# EAGLE design Protoshield V1.0 (EAGLE 9.6.2)
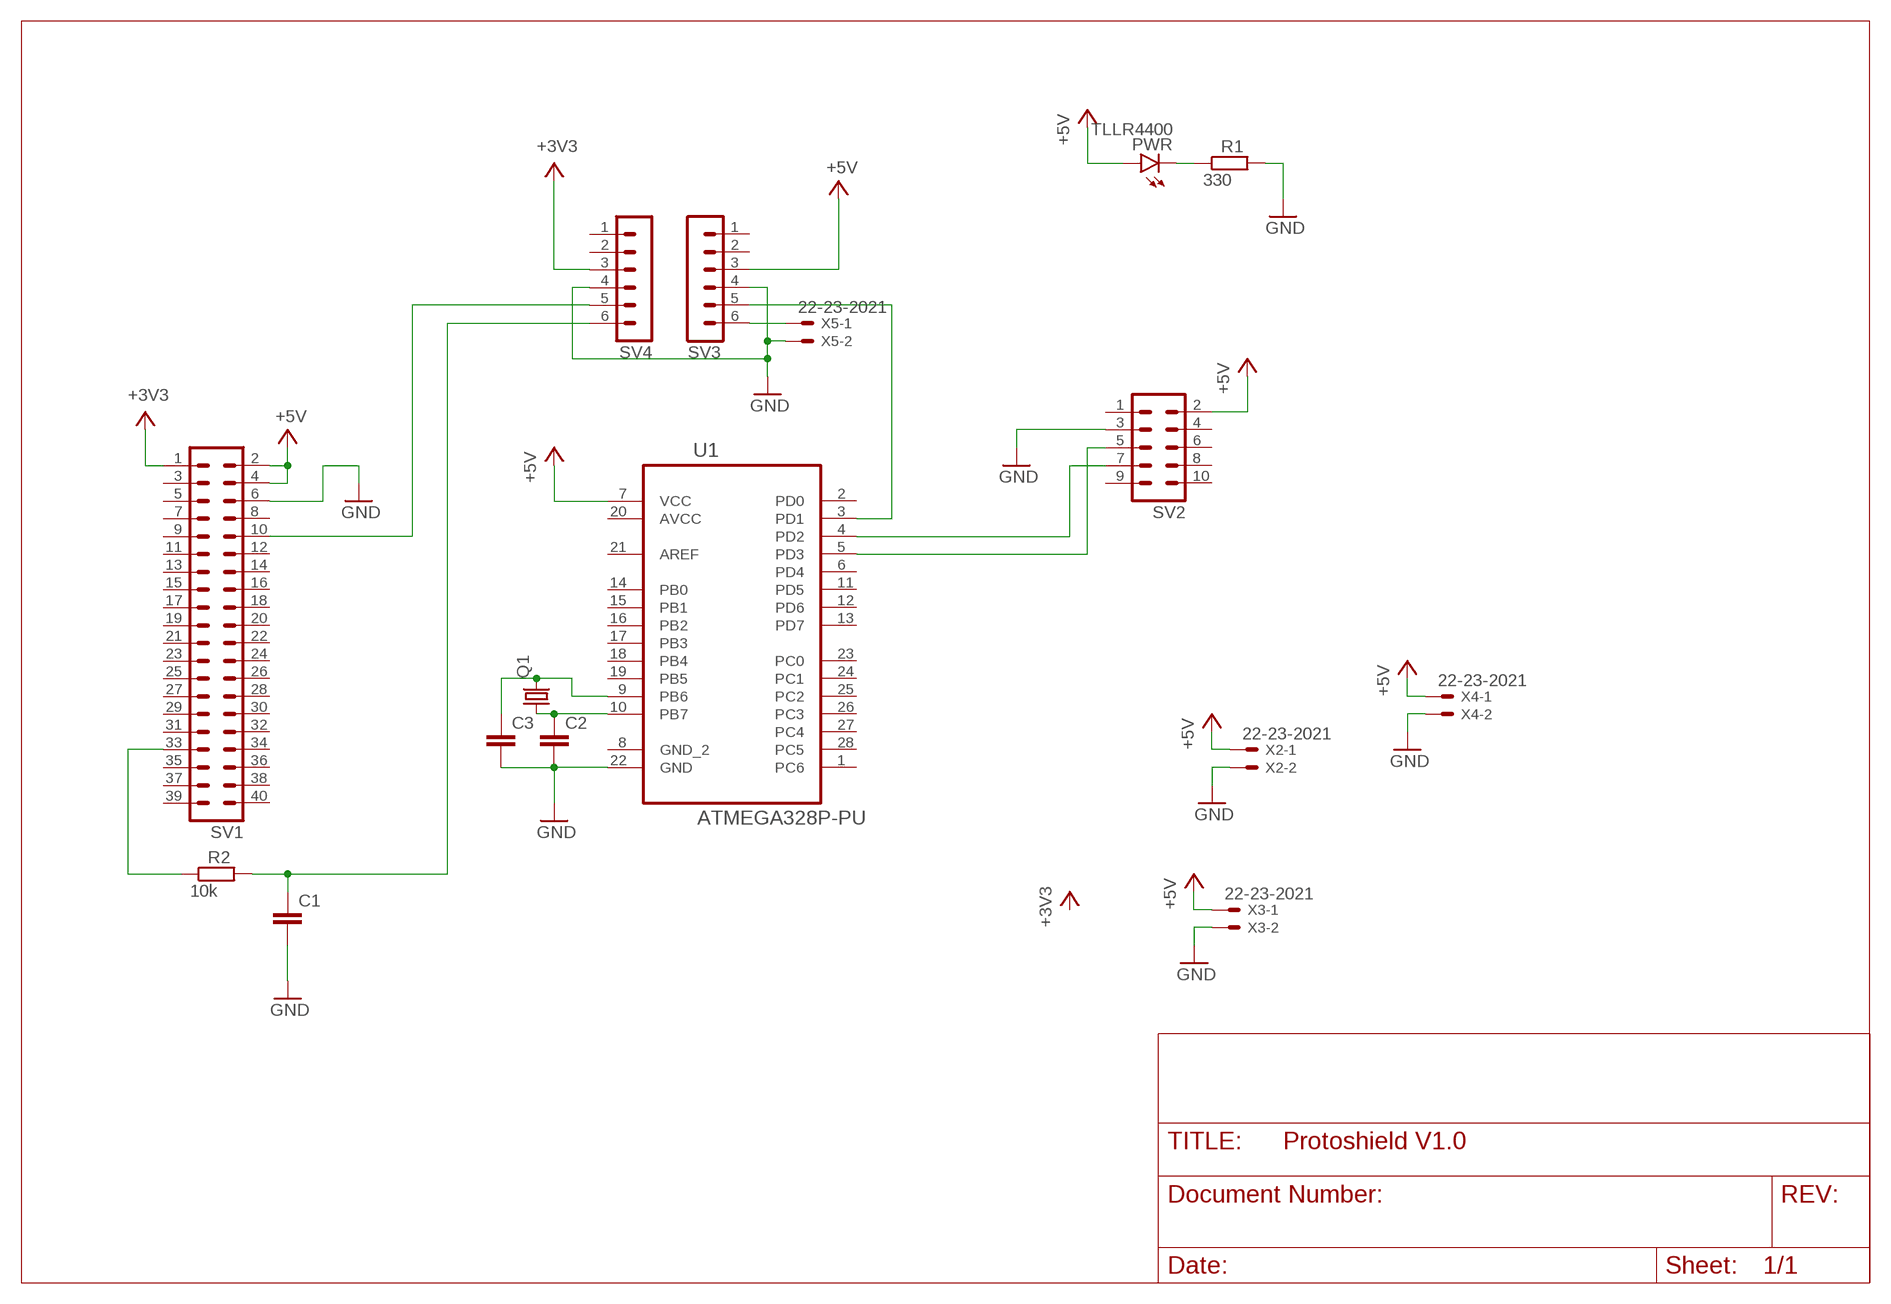
[diagram p0: schematic, sheet 1]

## Parts
C1  C-EU050-024X044  [C050-024X044]
C2  C-EU050-024X044  [C050-024X044]
C3  C-EU050-024X044  [C050-024X044]
PWR  TLLR4400  [LED3MM]
Q1  CRYSTALHC49S  [HC49/S]
R1  330  R-EU_0207/7  [0207/7]
R2  10k  R-EU_0207/7  [0207/7]
SV1  MA20-2  [MA20-2]
SV2  MA05-2  [MA05-2]
SV3  MA06-1  [MA06-1]
SV4  MA06-1  [MA06-1]
U1  ATMEGA328P-PU  [DIP254P762X457-28]
X2  22-23-2021  [22-23-2021]
X3  22-23-2021  [22-23-2021]
X4  22-23-2021  [22-23-2021]
X5  22-23-2021  [22-23-2021]

## Nets
+3V3: SV1.1 SV4.3
+5V: PWR.A SV1.2 SV1.4 SV2.2 SV3.3 U1.7(VCC) X2.1 X3.1 X4.1
GND: C1.2 C2.2 C3.2 R1.2 SV1.6 SV2.3 SV3.4 SV4.4 U1.22(GND) X2.2 X3.2 X4.2 X5.2
N$1: SV2.7 U1.4(PD2)
N$2: SV2.5 U1.5(PD3)
N$3: PWR.K(C) R1.1
N$38: SV3.6 X5.1
N$54: C3.1 Q1.2 U1.9(PB6)
N$151: C2.1 Q1.1 U1.10(PB7)
N$407: R2.1 SV1.33
N$436: SV3.5 U1.3(PD1)
N$437: SV1.10 SV4.5
N$438: C1.1 R2.2 SV4.6
Unconnected: SV1.3 SV1.5 SV1.7 SV1.8 SV1.9 SV1.11 SV1.12 SV1.13 SV1.14 SV1.15 SV1.16 SV1.17 SV1.18 SV1.19 SV1.20 SV1.21 SV1.22 SV1.23 SV1.24 SV1.25 SV1.26 SV1.27 SV1.28 SV1.29 SV1.30 SV1.31 SV1.32 SV1.34 SV1.35 SV1.36 SV1.37 SV1.38 SV1.39 SV1.40 SV2.1 SV2.4 SV2.6 SV2.8 SV2.9 SV2.10 SV3.1 SV3.2 SV4.1 SV4.2 U1.1(PC6) U1.2(PD0) U1.6(PD4) U1.8(GND_2) U1.11(PD5) U1.12(PD6) U1.13(PD7) U1.14(PB0) U1.15(PB1) U1.16(PB2) U1.17(PB3) U1.18(PB4) U1.19(PB5) U1.21(AREF) U1.23(PC0) U1.24(PC1) U1.25(PC2) U1.26(PC3) U1.27(PC4) U1.28(PC5)

## Power pins joined to a net without a drawn wire
AVCC: U1.20(AVCC)

## Library data of the parts
C1-C3 = rcl:C-EU: CAPACITOR, European symbol; SPICEPREFIX: C
PWR = led:TLLR4400: Low Current (2mA) LED 3 mm Tinted Diffused Package color RED Source: Data sheet <http://www.farnell.com/datasheets/391100.pdf>; MF: VISHAY SEMICONDUCTOR; OC_FARNELL: 1612437
Q1 = crystal:CRYSTAL: CRYSTAL; OC_FARNELL: 1667008; OC_NEWARK: unknown
R1 R2 = rcl:R-EU_: RESISTOR, European symbol; SPICEPREFIX: R
SV1 = con-lstb:MA20-2: PIN HEADER; OC_FARNELL: unknown; OC_NEWARK: unknown
SV2 = con-lstb:MA05-2: PIN HEADER; OC_FARNELL: unknown; OC_NEWARK: unknown
SV3 SV4 = con-lstb:MA06-1: PIN HEADER; OC_FARNELL: unknown; OC_NEWARK: unknown
U1 = Atmel_By_element14_Batch_1-00:ATMEGA328P-PU: 8-bit Microcontroller with In-System Programmable Flash; MPN: ATMEGA328P-PU; OC_FARNELL: 1715487; OC_NEWARK: 15R0268; PACKAGE: PDIP-28; SUPPLIER: Atmel
X2-X5 = con-molex:22-23-2021: .100" (2.54mm) Center Header - 2 Pin; MF: MOLEX; MPN: 22-23-2021; OC_FARNELL: 1462926; OC_NEWARK: 25C3832

## Board
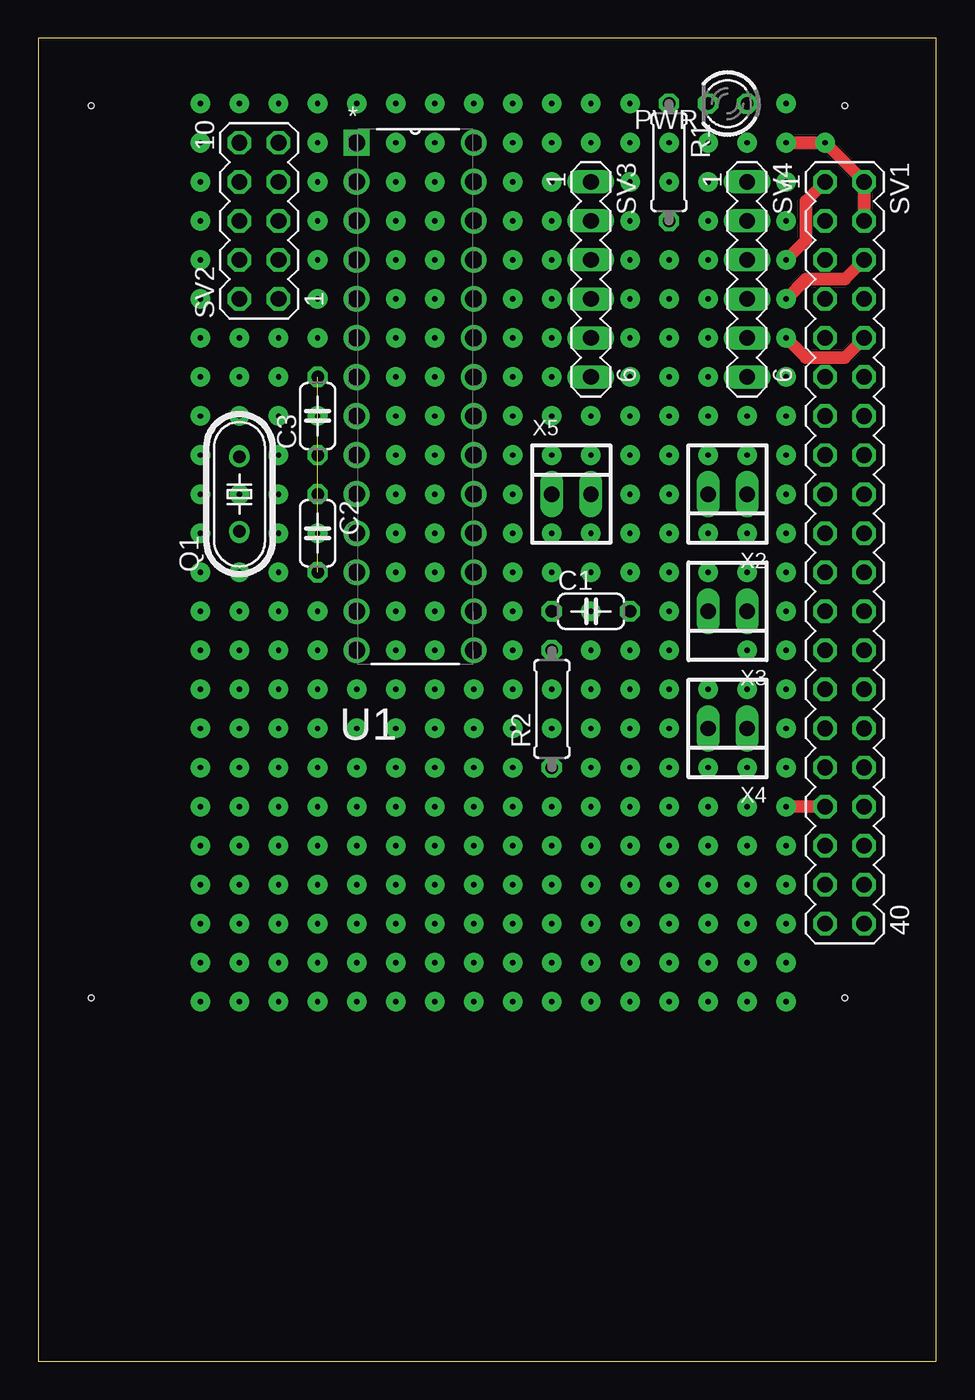
[diagram p1: board, top side]
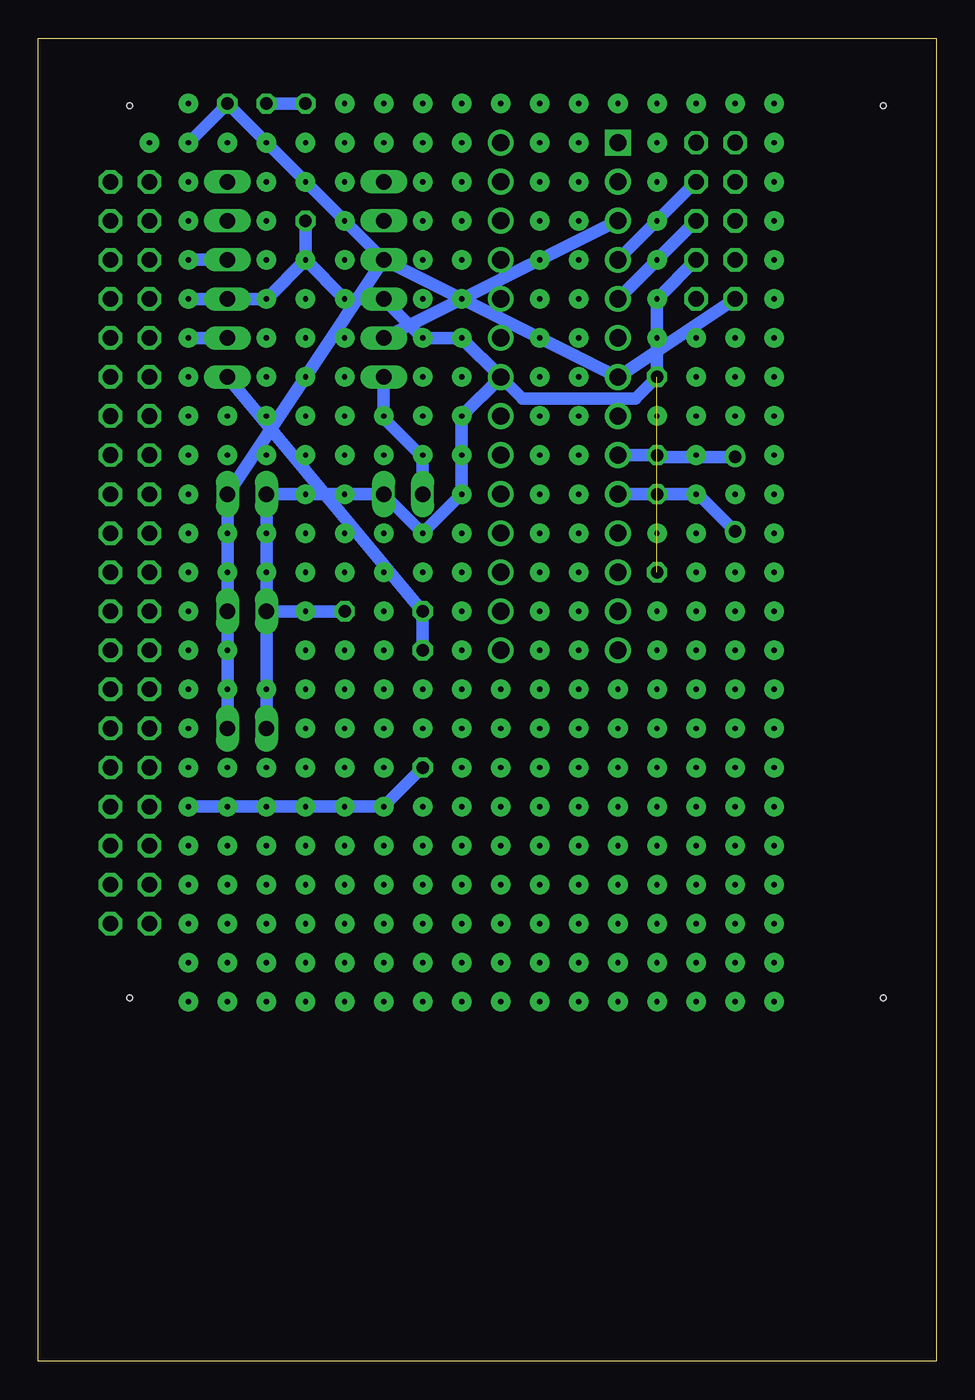
[diagram p2: board, bottom side, seen from below]

Size 58.4 x 86.03 mm. Coordinates in mm from the lower left corner, seen from the top.
Outline: 0,0 58.4,0 58.4,86.03 0,86.03 0,0
Copper layers (1*16): Top 0.035mm / dielectric 1.5mm / Bottom 0.035mm
Design rules "default": minimum track width 6mil, minimum drill 0.35mm, track to track 6mil, track to pad 6mil, pad to pad 6mil, via to via 6mil, smd to smd 6mil, copper to edge 40mil, drill to drill 6mil, minimum pad ring 10mil, minimum via ring 8mil, stop-mask expansion 4mil, vias tented up to drill 0mil, thermal gap 10mil
Holes 0.35 mm at 52.45,23.62 3.43,23.62 3.43,81.66 52.45,81.66

### Footprints (pad centres in the part's own frame; a part is rotated, then mirrored left to right if it is on the bottom)
C050-024X044 = drill 0.813 octagon: 1 -2.54,0; 2 2.54,0
LED3MM = drill 0.813 octagon: A -1.27,0; K 1.27,0
HC49/S = drill 0.813: 1 -2.413,0; 2 2.413,0
0207/7 = drill 0.813 octagon: 1 -3.81,0; 2 3.81,0
MA20-2 = drill 1.016 octagon: 1 -24.13,-1.27; 2 -24.13,1.27; 3 -21.59,-1.27; 4 -21.59,1.27; 5 -19.05,-1.27; 6 -19.05,1.27; 7 -16.51,-1.27; 8 -16.51,1.27; 9 -13.97,-1.27; 10 -13.97,1.27; 11 -11.43,-1.27; 12 -11.43,1.27; 13 -8.89,-1.27; 14 -8.89,1.27; 15 -6.35,-1.27; 16 -6.35,1.27; 17 -3.81,-1.27; 18 -3.81,1.27; 19 -1.27,-1.27; 20 -1.27,1.27; 21 1.27,-1.27; 22 1.27,1.27; 23 3.81,-1.27; 24 3.81,1.27; 25 6.35,-1.27; 26 6.35,1.27; 27 8.89,-1.27; 28 8.89,1.27; 29 11.43,-1.27; 30 11.43,1.27; 31 13.97,-1.27; 32 13.97,1.27; 33 16.51,-1.27; 34 16.51,1.27; 35 19.05,-1.27; 36 19.05,1.27; 37 21.59,-1.27; 38 21.59,1.27; 39 24.13,-1.27; 40 24.13,1.27
MA05-2 = drill 1.016 octagon: 1 -5.08,-1.27; 2 -5.08,1.27; 3 -2.54,-1.27; 4 -2.54,1.27; 5 0,-1.27; 6 0,1.27; 7 2.54,-1.27; 8 2.54,1.27; 9 5.08,-1.27; 10 5.08,1.27
MA06-1 = drill 1.016 long: 1 -6.35,0; 2 -3.81,0; 3 -1.27,0; 4 1.27,0; 5 3.81,0; 6 6.35,0
DIP254P762X457-28 = drill 1.118 square: 1 -7.62,33.02 | drill 1.118: 2 -7.62,30.48; 3 -7.62,27.94; 4 -7.62,25.4; 5 -7.62,22.86; 6 -7.62,20.32; 7 -7.62,17.78; 8 -7.62,15.24; 9 -7.62,12.7; 10 -7.62,10.16; 11 -7.62,7.62; 12 -7.62,5.08; 13 -7.62,2.54; 14 -7.62,0; 15 0,0; 16 0,2.54; 17 0,5.08; 18 0,7.62; 19 0,10.16; 20 0,12.7; 21 0,15.24; 22 0,17.78; 23 0,20.32; 24 0,22.86; 25 0,25.4; 26 0,27.94; 27 0,30.48; 28 0,33.02
22-23-2021 = drill 1 long: 1 -1.27,0; 2 1.27,0

### Placement (x,y rotation side)
C1  35.94,48.77 0 top
C2  18.16,53.85 270 top
C3  18.16,61.47 90 top
PWR  44.83,81.79 180 top
Q1  13.08,56.39 90 top
R1  41.02,77.98 270 top
R2  33.4,42.42 90 top
SV1  52.45,52.58 270 top
SV2  14.35,74.17 90 top
SV3  35.94,70.36 270 top
SV4  46.1,70.36 270 top
U1  28.32,46.23 0 top
X2  44.83,56.39 180 top
X3  44.83,48.77 180 top
X4  44.83,41.15 180 top
X5  34.67,56.39 0 top

### Tracks (layer width: path | path; a pad name or v marks a point on that pad's centre or on a via)
+3V3  (via drill 0.35 pad 1.27)
  Top 0.813: SV1.1 49.91,75.44 49.91,72.9 v48.64,71.63
  Bottom 0.813: v48.64,71.63 SV4.3
+5V  (via drill 0.35 pad 1.27)
  Top 0.813: v48.64,79.25 51.18,79.25 SV1.2 SV1.4
  Bottom 0.813: X4.1 X3.1 X2.1 SV3.3 | v48.64,79.25 PWR.A SV3.3 | SV2.2 U1.7 SV3.3
GND  (via drill 0.35 pad 1.27)  (1 unrouted)
  Top 0.813: SV1.6 52.45,70.36 49.91,70.36 v48.64,69.09
  Bottom 0.813: X4.2 X3.2 | X3.2 X2.2 X5.2 33.4,53.85 30.86,56.39 30.86,61.47 U1.22 | C1.2 X3.2 | v41.02,71.63 43.56,69.09 SV4.4 v48.64,69.09 | v41.02,71.63 38.48,69.09 SV3.4 33.4,66.55 30.86,66.55 U1.22 | v41.02,71.63 R1.2 | U1.22 26.92,62.61 19.56,62.61 C3.2 18.16,69.09 SV2.3
N$1
  Bottom 0.813: U1.4 SV2.7
N$2
  Bottom 0.813: U1.5 SV2.5
N$3
  Bottom 0.813: R1.1 PWR.K
N$4  (via drill 0.35 pad 1.27)
  other vias: 51.18,79.25
N$5  (via drill 0.35 pad 1.27)
  other vias: 48.64,74.17
N$6  (via drill 0.35 pad 1.27)
  other vias: 46.1,76.71
N$7  (via drill 0.35 pad 1.27)
  other vias: 38.48,76.71
N$8  (via drill 0.35 pad 1.27)
  other vias: 43.56,76.71
N$9  (via drill 0.35 pad 1.27)
  other vias: 41.02,76.71
N$10  (via drill 0.35 pad 1.27)
  other vias: 35.94,76.71
N$11  (via drill 0.35 pad 1.27)
  other vias: 33.4,76.71
N$12  (via drill 0.35 pad 1.27)
  other vias: 46.1,74.17
N$13  (via drill 0.35 pad 1.27)
  other vias: 43.56,74.17
N$14  (via drill 0.35 pad 1.27)
  other vias: 38.48,74.17
N$15  (via drill 0.35 pad 1.27)
  other vias: 41.02,74.17
N$16  (via drill 0.35 pad 1.27)
  other vias: 35.94,74.17
N$17  (via drill 0.35 pad 1.27)
  other vias: 33.4,74.17
N$18  (via drill 0.35 pad 1.27)
  other vias: 30.86,76.71
N$19  (via drill 0.35 pad 1.27)
  other vias: 28.32,76.71
N$20  (via drill 0.35 pad 1.27)
  other vias: 25.78,76.71
N$21  (via drill 0.35 pad 1.27)
  other vias: 20.7,76.71
N$22  (via drill 0.35 pad 1.27)
  other vias: 23.24,76.71
N$23  (via drill 0.35 pad 1.27)
  other vias: 18.16,76.71
N$24  (via drill 0.35 pad 1.27)
  other vias: 15.62,76.71
N$25  (via drill 0.35 pad 1.27)
  other vias: 30.86,74.17
N$26  (via drill 0.35 pad 1.27)
  other vias: 28.32,74.17
N$27  (via drill 0.35 pad 1.27)
  other vias: 25.78,74.17
N$28  (via drill 0.35 pad 1.27)
  other vias: 20.7,74.17
N$29  (via drill 0.35 pad 1.27)
  other vias: 23.24,74.17
N$30  (via drill 0.35 pad 1.27)
  other vias: 18.16,74.17
N$31  (via drill 0.35 pad 1.27)
  other vias: 15.62,74.17
N$32  (via drill 0.35 pad 1.27)
  other vias: 10.54,76.71
N$33  (via drill 0.35 pad 1.27)
  other vias: 13.08,76.71
N$34  (via drill 0.35 pad 1.27)
  other vias: 48.64,76.71
N$35  (via drill 0.35 pad 1.27)
  other vias: 41.02,38.61
N$36  (via drill 0.35 pad 1.27)
  other vias: 10.54,74.17
N$37  (via drill 0.35 pad 1.27)
  other vias: 13.08,74.17
N$38
  Bottom 0.813: X5.1 33.4,58.8 35.94,61.34 SV3.6
N$39  (via drill 0.35 pad 1.27)
  other vias: 48.64,79.25
N$41  (via drill 0.35 pad 1.27)
  other vias: 46.1,71.63
N$42  (via drill 0.35 pad 1.27)
  other vias: 43.56,71.63
N$43  (via drill 0.35 pad 1.27)
  other vias: 38.48,71.63
N$45  (via drill 0.35 pad 1.27)
  other vias: 35.94,71.63
N$46  (via drill 0.35 pad 1.27)
  other vias: 33.4,71.63
N$47  (via drill 0.35 pad 1.27)
  other vias: 41.02,64.01
N$48  (via drill 0.35 pad 1.27)
  other vias: 46.1,69.09
N$49  (via drill 0.35 pad 1.27)
  other vias: 43.56,69.09
N$50  (via drill 0.35 pad 1.27)
  other vias: 38.48,69.09
N$51  (via drill 0.35 pad 1.27)
  other vias: 41.02,69.09
N$52  (via drill 0.35 pad 1.27)
  other vias: 35.94,69.09
N$53  (via drill 0.35 pad 1.27)
  other vias: 33.4,69.09
N$54
  Bottom 0.813: U1.9 C3.1 18.03,58.8 Q1.2
N$55  (via drill 0.35 pad 1.27)
  other vias: 28.32,71.63
N$56  (via drill 0.35 pad 1.27)
  other vias: 25.78,71.63
N$57  (via drill 0.35 pad 1.27)
  other vias: 20.7,71.63
N$58  (via drill 0.35 pad 1.27)
  other vias: 23.24,71.63
N$59  (via drill 0.35 pad 1.27)
  other vias: 18.16,71.63
N$60  (via drill 0.35 pad 1.27)
  other vias: 15.62,71.63
N$61  (via drill 0.35 pad 1.27)
  other vias: 30.86,69.09
N$62  (via drill 0.35 pad 1.27)
  other vias: 28.32,69.09
N$63  (via drill 0.35 pad 1.27)
  other vias: 25.78,69.09
N$64  (via drill 0.35 pad 1.27)
  other vias: 20.7,69.09
N$65  (via drill 0.35 pad 1.27)
  other vias: 23.24,69.09
N$66  (via drill 0.35 pad 1.27)
  other vias: 18.16,69.09
N$67  (via drill 0.35 pad 1.27)
  other vias: 15.62,69.09
N$68  (via drill 0.35 pad 1.27)
  other vias: 10.54,71.63
N$69  (via drill 0.35 pad 1.27)
  other vias: 13.08,71.63
N$72  (via drill 0.35 pad 1.27)
  other vias: 10.54,69.09
N$73  (via drill 0.35 pad 1.27)
  other vias: 13.08,69.09
N$76  (via drill 0.35 pad 1.27)
  other vias: 48.64,66.55
N$77  (via drill 0.35 pad 1.27)
  other vias: 46.1,66.55
N$78  (via drill 0.35 pad 1.27)
  other vias: 43.56,66.55
N$79  (via drill 0.35 pad 1.27)
  other vias: 38.48,66.55
N$80  (via drill 0.35 pad 1.27)
  other vias: 41.02,66.55
N$81  (via drill 0.35 pad 1.27)
  other vias: 35.94,66.55
N$82  (via drill 0.35 pad 1.27)
  other vias: 33.4,66.55
N$83  (via drill 0.35 pad 1.27)
  other vias: 48.64,64.01
N$84  (via drill 0.35 pad 1.27)
  other vias: 46.1,64.01
N$85  (via drill 0.35 pad 1.27)
  other vias: 43.56,64.01
N$86  (via drill 0.35 pad 1.27)
  other vias: 38.48,64.01
N$87  (via drill 0.35 pad 1.27)
  other vias: 48.64,71.63
N$88  (via drill 0.35 pad 1.27)
  other vias: 35.94,64.01
N$89  (via drill 0.35 pad 1.27)
  other vias: 33.4,64.01
N$90  (via drill 0.35 pad 1.27)
  other vias: 30.86,66.55
N$91  (via drill 0.35 pad 1.27)
  other vias: 28.32,66.55
N$92  (via drill 0.35 pad 1.27)
  other vias: 25.78,66.55
N$93  (via drill 0.35 pad 1.27)
  other vias: 20.7,66.55
N$94  (via drill 0.35 pad 1.27)
  other vias: 23.24,66.55
N$95  (via drill 0.35 pad 1.27)
  other vias: 18.16,66.55
N$96  (via drill 0.35 pad 1.27)
  other vias: 15.62,66.55
N$97  (via drill 0.35 pad 1.27)
  other vias: 30.86,64.01
N$98  (via drill 0.35 pad 1.27)
  other vias: 28.32,64.01
N$99  (via drill 0.35 pad 1.27)
  other vias: 25.78,64.01
N$100  (via drill 0.35 pad 1.27)
  other vias: 20.7,64.01
N$101  (via drill 0.35 pad 1.27)
  other vias: 23.24,64.01
N$102  (via drill 0.35 pad 1.27)
  other vias: 18.16,64.01
N$103  (via drill 0.35 pad 1.27)
  other vias: 15.62,64.01
N$104  (via drill 0.35 pad 1.27)
  other vias: 10.54,66.55
N$105  (via drill 0.35 pad 1.27)
  other vias: 13.08,66.55
N$108  (via drill 0.35 pad 1.27)
  other vias: 10.54,64.01
N$109  (via drill 0.35 pad 1.27)
  other vias: 13.08,64.01
N$112  (via drill 0.35 pad 1.27)
  other vias: 48.64,61.47
N$113  (via drill 0.35 pad 1.27)
  other vias: 46.1,61.47
N$114  (via drill 0.35 pad 1.27)
  other vias: 43.56,61.47
N$115  (via drill 0.35 pad 1.27)
  other vias: 38.48,61.47
N$116  (via drill 0.35 pad 1.27)
  other vias: 41.02,61.47
N$117  (via drill 0.35 pad 1.27)
  other vias: 35.94,61.47
N$118  (via drill 0.35 pad 1.27)
  other vias: 33.4,61.47
N$119  (via drill 0.35 pad 1.27)
  other vias: 48.64,58.93
N$120  (via drill 0.35 pad 1.27)
  other vias: 46.1,58.93
N$122  (via drill 0.35 pad 1.27)
  other vias: 38.48,58.93
N$123  (via drill 0.35 pad 1.27)
  other vias: 41.02,58.93
N$124  (via drill 0.35 pad 1.27)
  other vias: 35.94,58.93
N$125  (via drill 0.35 pad 1.27)
  other vias: 33.4,58.93
N$126  (via drill 0.35 pad 1.27)
  other vias: 30.86,61.47
N$127  (via drill 0.35 pad 1.27)
  other vias: 28.32,61.47
N$128  (via drill 0.35 pad 1.27)
  other vias: 25.78,61.47
N$129  (via drill 0.35 pad 1.27)
  other vias: 20.7,61.47
N$130  (via drill 0.35 pad 1.27)
  other vias: 23.24,61.47
N$131  (via drill 0.35 pad 1.27)
  other vias: 18.16,61.47
N$132  (via drill 0.35 pad 1.27)
  other vias: 15.62,61.47
N$133  (via drill 0.35 pad 1.27)
  other vias: 30.86,58.93
N$134  (via drill 0.35 pad 1.27)
  other vias: 28.32,58.93
N$135  (via drill 0.35 pad 1.27)
  other vias: 25.78,58.93
N$136  (via drill 0.35 pad 1.27)
  other vias: 20.7,58.93
N$137  (via drill 0.35 pad 1.27)
  other vias: 23.24,58.93
N$138  (via drill 0.35 pad 1.27)
  other vias: 18.16,58.93
N$139  (via drill 0.35 pad 1.27)
  other vias: 15.62,58.93
N$140  (via drill 0.35 pad 1.27)
  other vias: 10.54,61.47
N$141  (via drill 0.35 pad 1.27)
  other vias: 13.08,61.47
N$144  (via drill 0.35 pad 1.27)
  other vias: 10.54,58.93
N$145  (via drill 0.35 pad 1.27)
  other vias: 13.08,58.93
N$148  (via drill 0.35 pad 1.27)
  other vias: 48.64,56.39
N$149  (via drill 0.35 pad 1.27)
  other vias: 46.1,56.39
N$150  (via drill 0.35 pad 1.27)
  other vias: 43.56,56.39
N$151
  Bottom 0.813: U1.10 C2.1 15.49,56.39 Q1.1
N$152  (via drill 0.35 pad 1.27)
  other vias: 41.02,56.39
N$153  (via drill 0.35 pad 1.27)
  other vias: 35.94,56.39
N$154  (via drill 0.35 pad 1.27)
  other vias: 33.4,56.39
N$155  (via drill 0.35 pad 1.27)
  other vias: 48.64,53.85
N$156  (via drill 0.35 pad 1.27)
  other vias: 46.1,53.85
N$157  (via drill 0.35 pad 1.27)
  other vias: 43.56,53.85
N$158  (via drill 0.35 pad 1.27)
  other vias: 38.48,53.85
N$159  (via drill 0.35 pad 1.27)
  other vias: 41.02,53.85
N$160  (via drill 0.35 pad 1.27)
  other vias: 35.94,53.85
N$161  (via drill 0.35 pad 1.27)
  other vias: 33.4,53.85
N$162  (via drill 0.35 pad 1.27)
  other vias: 30.86,56.39
N$163  (via drill 0.35 pad 1.27)
  other vias: 28.32,56.39
N$164  (via drill 0.35 pad 1.27)
  other vias: 25.78,56.39
N$165  (via drill 0.35 pad 1.27)
  other vias: 20.7,56.39
N$166  (via drill 0.35 pad 1.27)
  other vias: 23.24,56.39
N$167  (via drill 0.35 pad 1.27)
  other vias: 18.16,56.39
N$168  (via drill 0.35 pad 1.27)
  other vias: 15.62,56.39
N$169  (via drill 0.35 pad 1.27)
  other vias: 30.86,53.85
N$170  (via drill 0.35 pad 1.27)
  other vias: 28.32,53.85
N$171  (via drill 0.35 pad 1.27)
  other vias: 25.78,53.85
N$172  (via drill 0.35 pad 1.27)
  other vias: 20.7,53.85
N$173  (via drill 0.35 pad 1.27)
  other vias: 23.24,53.85
N$174  (via drill 0.35 pad 1.27)
  other vias: 18.16,53.85
N$175  (via drill 0.35 pad 1.27)
  other vias: 15.62,53.85
N$176  (via drill 0.35 pad 1.27)
  other vias: 10.54,56.39
N$177  (via drill 0.35 pad 1.27)
  other vias: 13.08,56.39
N$180  (via drill 0.35 pad 1.27)
  other vias: 10.54,53.85
N$181  (via drill 0.35 pad 1.27)
  other vias: 13.08,53.85
N$184  (via drill 0.35 pad 1.27)
  other vias: 48.64,51.31
N$185  (via drill 0.35 pad 1.27)
  other vias: 46.1,51.31
N$186  (via drill 0.35 pad 1.27)
  other vias: 43.56,51.31
N$187  (via drill 0.35 pad 1.27)
  other vias: 38.48,51.31
N$188  (via drill 0.35 pad 1.27)
  other vias: 41.02,51.31
N$189  (via drill 0.35 pad 1.27)
  other vias: 35.94,51.31
N$190  (via drill 0.35 pad 1.27)
  other vias: 33.4,51.31
N$191  (via drill 0.35 pad 1.27)
  other vias: 48.64,48.77
N$192  (via drill 0.35 pad 1.27)
  other vias: 46.1,48.77
N$193  (via drill 0.35 pad 1.27)
  other vias: 43.56,48.77
N$194  (via drill 0.35 pad 1.27)
  other vias: 38.48,48.77
N$195  (via drill 0.35 pad 1.27)
  other vias: 41.02,48.77
N$196  (via drill 0.35 pad 1.27)
  other vias: 35.94,48.77
N$197  (via drill 0.35 pad 1.27)
  other vias: 33.4,48.77
N$198  (via drill 0.35 pad 1.27)
  other vias: 30.86,51.31
N$199  (via drill 0.35 pad 1.27)
  other vias: 28.32,51.31
N$200  (via drill 0.35 pad 1.27)
  other vias: 25.78,51.31
N$201  (via drill 0.35 pad 1.27)
  other vias: 20.7,51.31
N$202  (via drill 0.35 pad 1.27)
  other vias: 23.24,51.31
N$203  (via drill 0.35 pad 1.27)
  other vias: 18.16,51.31
N$204  (via drill 0.35 pad 1.27)
  other vias: 15.62,51.31
N$205  (via drill 0.35 pad 1.27)
  other vias: 30.86,48.77
N$206  (via drill 0.35 pad 1.27)
  other vias: 28.32,48.77
N$207  (via drill 0.35 pad 1.27)
  other vias: 25.78,48.77
N$208  (via drill 0.35 pad 1.27)
  other vias: 20.7,48.77
N$209  (via drill 0.35 pad 1.27)
  other vias: 23.24,48.77
N$210  (via drill 0.35 pad 1.27)
  other vias: 18.16,48.77
N$211  (via drill 0.35 pad 1.27)
  other vias: 15.62,48.77
N$212  (via drill 0.35 pad 1.27)
  other vias: 10.54,51.31
N$213  (via drill 0.35 pad 1.27)
  other vias: 13.08,51.31
N$216  (via drill 0.35 pad 1.27)
  other vias: 10.54,48.77
N$217  (via drill 0.35 pad 1.27)
  other vias: 13.08,48.77
N$220  (via drill 0.35 pad 1.27)
  other vias: 48.64,46.23
N$221  (via drill 0.35 pad 1.27)
  other vias: 46.1,46.23
N$222  (via drill 0.35 pad 1.27)
  other vias: 43.56,58.93
N$223  (via drill 0.35 pad 1.27)
  other vias: 38.48,46.23
N$224  (via drill 0.35 pad 1.27)
  other vias: 41.02,46.23
N$225  (via drill 0.35 pad 1.27)
  other vias: 35.94,46.23
N$226  (via drill 0.35 pad 1.27)
  other vias: 33.4,46.23
N$227  (via drill 0.35 pad 1.27)
  other vias: 48.64,43.69
N$228  (via drill 0.35 pad 1.27)
  other vias: 46.1,43.69
N$229  (via drill 0.35 pad 1.27)
  other vias: 43.56,43.69
N$230  (via drill 0.35 pad 1.27)
  other vias: 38.48,43.69
N$231  (via drill 0.35 pad 1.27)
  other vias: 41.02,43.69
N$232  (via drill 0.35 pad 1.27)
  other vias: 35.94,43.69
N$233  (via drill 0.35 pad 1.27)
  other vias: 33.4,43.69
N$234  (via drill 0.35 pad 1.27)
  other vias: 30.86,46.23
N$235  (via drill 0.35 pad 1.27)
  other vias: 28.32,46.23
N$236  (via drill 0.35 pad 1.27)
  other vias: 25.78,46.23
N$237  (via drill 0.35 pad 1.27)
  other vias: 20.7,46.23
N$238  (via drill 0.35 pad 1.27)
  other vias: 23.24,46.23
N$239  (via drill 0.35 pad 1.27)
  other vias: 18.16,46.23
N$240  (via drill 0.35 pad 1.27)
  other vias: 15.62,46.23
N$241  (via drill 0.35 pad 1.27)
  other vias: 30.86,43.69
N$242  (via drill 0.35 pad 1.27)
  other vias: 28.32,43.69
N$243  (via drill 0.35 pad 1.27)
  other vias: 25.78,43.69
N$244  (via drill 0.35 pad 1.27)
  other vias: 20.7,43.69
N$245  (via drill 0.35 pad 1.27)
  other vias: 23.24,43.69
N$246  (via drill 0.35 pad 1.27)
  other vias: 18.16,43.69
N$247  (via drill 0.35 pad 1.27)
  other vias: 15.62,43.69
N$248  (via drill 0.35 pad 1.27)
  other vias: 10.54,46.23
N$249  (via drill 0.35 pad 1.27)
  other vias: 13.08,46.23
N$252  (via drill 0.35 pad 1.27)
  other vias: 10.54,43.69
N$253  (via drill 0.35 pad 1.27)
  other vias: 13.08,43.69
N$256  (via drill 0.35 pad 1.27)
  other vias: 48.64,41.15
N$257  (via drill 0.35 pad 1.27)
  other vias: 46.1,41.15
N$258  (via drill 0.35 pad 1.27)
  other vias: 43.56,41.15
N$259  (via drill 0.35 pad 1.27)
  other vias: 38.48,41.15
N$260  (via drill 0.35 pad 1.27)
  other vias: 41.02,41.15
N$261  (via drill 0.35 pad 1.27)
  other vias: 35.94,41.15
N$262  (via drill 0.35 pad 1.27)
  other vias: 33.4,41.15
N$263  (via drill 0.35 pad 1.27)
  other vias: 48.64,38.61
N$264  (via drill 0.35 pad 1.27)
  other vias: 46.1,38.61
N$265  (via drill 0.35 pad 1.27)
  other vias: 43.56,38.61
N$266  (via drill 0.35 pad 1.27)
  other vias: 38.48,38.61
N$268  (via drill 0.35 pad 1.27)
  other vias: 35.94,38.61
N$269  (via drill 0.35 pad 1.27)
  other vias: 33.4,38.61
N$270  (via drill 0.35 pad 1.27)
  other vias: 30.86,41.15
N$271  (via drill 0.35 pad 1.27)
  other vias: 28.32,41.15
N$272  (via drill 0.35 pad 1.27)
  other vias: 25.78,41.15
N$273  (via drill 0.35 pad 1.27)
  other vias: 20.7,41.15
N$274  (via drill 0.35 pad 1.27)
  other vias: 23.24,41.15
N$275  (via drill 0.35 pad 1.27)
  other vias: 18.16,41.15
N$276  (via drill 0.35 pad 1.27)
  other vias: 15.62,41.15
N$277  (via drill 0.35 pad 1.27)
  other vias: 30.86,38.61
N$278  (via drill 0.35 pad 1.27)
  other vias: 28.32,38.61
N$279  (via drill 0.35 pad 1.27)
  other vias: 25.78,38.61
N$280  (via drill 0.35 pad 1.27)
  other vias: 20.7,38.61
N$281  (via drill 0.35 pad 1.27)
  other vias: 23.24,38.61
N$282  (via drill 0.35 pad 1.27)
  other vias: 18.16,38.61
N$283  (via drill 0.35 pad 1.27)
  other vias: 15.62,38.61
N$284  (via drill 0.35 pad 1.27)
  other vias: 10.54,41.15
N$285  (via drill 0.35 pad 1.27)
  other vias: 13.08,41.15
N$288  (via drill 0.35 pad 1.27)
  other vias: 10.54,38.61
N$289  (via drill 0.35 pad 1.27)
  other vias: 13.08,38.61
N$292  (via drill 0.35 pad 1.27)
  other vias: 48.64,36.07
N$293  (via drill 0.35 pad 1.27)
  other vias: 46.1,36.07
N$294  (via drill 0.35 pad 1.27)
  other vias: 43.56,36.07
N$295  (via drill 0.35 pad 1.27)
  other vias: 38.48,36.07
N$296  (via drill 0.35 pad 1.27)
  other vias: 41.02,36.07
N$297  (via drill 0.35 pad 1.27)
  other vias: 35.94,36.07
N$298  (via drill 0.35 pad 1.27)
  other vias: 33.4,36.07
N$299  (via drill 0.35 pad 1.27)
  other vias: 48.64,33.53
N$300  (via drill 0.35 pad 1.27)
  other vias: 46.1,33.53
N$301  (via drill 0.35 pad 1.27)
  other vias: 43.56,33.53
N$302  (via drill 0.35 pad 1.27)
  other vias: 38.48,33.53
N$303  (via drill 0.35 pad 1.27)
  other vias: 41.02,33.53
N$304  (via drill 0.35 pad 1.27)
  other vias: 35.94,33.53
N$305  (via drill 0.35 pad 1.27)
  other vias: 33.4,33.53
N$306  (via drill 0.35 pad 1.27)
  other vias: 30.86,36.07
N$307  (via drill 0.35 pad 1.27)
  other vias: 28.32,36.07
N$308  (via drill 0.35 pad 1.27)
  other vias: 25.78,36.07
N$309  (via drill 0.35 pad 1.27)
  other vias: 20.7,36.07
N$310  (via drill 0.35 pad 1.27)
  other vias: 23.24,36.07
N$311  (via drill 0.35 pad 1.27)
  other vias: 18.16,36.07
N$312  (via drill 0.35 pad 1.27)
  other vias: 15.62,36.07
N$313  (via drill 0.35 pad 1.27)
  other vias: 30.86,33.53
N$314  (via drill 0.35 pad 1.27)
  other vias: 28.32,33.53
N$315  (via drill 0.35 pad 1.27)
  other vias: 25.78,33.53
N$316  (via drill 0.35 pad 1.27)
  other vias: 20.7,33.53
N$317  (via drill 0.35 pad 1.27)
  other vias: 23.24,33.53
N$318  (via drill 0.35 pad 1.27)
  other vias: 18.16,33.53
N$319  (via drill 0.35 pad 1.27)
  other vias: 15.62,33.53
N$320  (via drill 0.35 pad 1.27)
  other vias: 10.54,36.07
N$321  (via drill 0.35 pad 1.27)
  other vias: 13.08,36.07
N$324  (via drill 0.35 pad 1.27)
  other vias: 10.54,33.53
N$325  (via drill 0.35 pad 1.27)
  other vias: 13.08,33.53
N$328  (via drill 0.35 pad 1.27)
  other vias: 48.64,30.99
N$329  (via drill 0.35 pad 1.27)
  other vias: 46.1,30.99
N$330  (via drill 0.35 pad 1.27)
  other vias: 43.56,30.99
N$331  (via drill 0.35 pad 1.27)
  other vias: 38.48,30.99
N$332  (via drill 0.35 pad 1.27)
  other vias: 41.02,30.99
N$333  (via drill 0.35 pad 1.27)
  other vias: 35.94,30.99
N$334  (via drill 0.35 pad 1.27)
  other vias: 33.4,30.99
N$335  (via drill 0.35 pad 1.27)
  other vias: 48.64,28.45
N$336  (via drill 0.35 pad 1.27)
  other vias: 46.1,28.45
N$337  (via drill 0.35 pad 1.27)
  other vias: 43.56,28.45
N$338  (via drill 0.35 pad 1.27)
  other vias: 38.48,28.45
N$339  (via drill 0.35 pad 1.27)
  other vias: 41.02,28.45
N$340  (via drill 0.35 pad 1.27)
  other vias: 35.94,28.45
N$341  (via drill 0.35 pad 1.27)
  other vias: 33.4,28.45
N$342  (via drill 0.35 pad 1.27)
  other vias: 30.86,30.99
N$343  (via drill 0.35 pad 1.27)
  other vias: 28.32,30.99
N$344  (via drill 0.35 pad 1.27)
  other vias: 25.78,30.99
N$345  (via drill 0.35 pad 1.27)
  other vias: 20.7,30.99
N$346  (via drill 0.35 pad 1.27)
  other vias: 23.24,30.99
N$347  (via drill 0.35 pad 1.27)
  other vias: 18.16,30.99
N$348  (via drill 0.35 pad 1.27)
  other vias: 15.62,30.99
N$349  (via drill 0.35 pad 1.27)
  other vias: 30.86,28.45
N$350  (via drill 0.35 pad 1.27)
  other vias: 28.32,28.45
N$351  (via drill 0.35 pad 1.27)
  other vias: 25.78,28.45
N$352  (via drill 0.35 pad 1.27)
  other vias: 20.7,28.45
N$353  (via drill 0.35 pad 1.27)
  other vias: 23.24,28.45
N$354  (via drill 0.35 pad 1.27)
  other vias: 18.16,28.45
N$355  (via drill 0.35 pad 1.27)
  other vias: 15.62,28.45
N$356  (via drill 0.35 pad 1.27)
  other vias: 10.54,30.99
N$357  (via drill 0.35 pad 1.27)
  other vias: 13.08,30.99
N$360  (via drill 0.35 pad 1.27)
  other vias: 10.54,28.45
N$361  (via drill 0.35 pad 1.27)
  other vias: 13.08,28.45
N$364  (via drill 0.35 pad 1.27)
  other vias: 48.64,25.91
N$365  (via drill 0.35 pad 1.27)
  other vias: 46.1,25.91
N$366  (via drill 0.35 pad 1.27)
  other vias: 43.56,25.91
N$367  (via drill 0.35 pad 1.27)
  other vias: 38.48,25.91
N$368  (via drill 0.35 pad 1.27)
  other vias: 41.02,25.91
N$369  (via drill 0.35 pad 1.27)
  other vias: 35.94,25.91
N$370  (via drill 0.35 pad 1.27)
  other vias: 33.4,25.91
N$371  (via drill 0.35 pad 1.27)
  other vias: 48.64,23.37
N$372  (via drill 0.35 pad 1.27)
  other vias: 46.1,23.37
N$373  (via drill 0.35 pad 1.27)
  other vias: 43.56,23.37
N$374  (via drill 0.35 pad 1.27)
  other vias: 38.48,23.37
N$375  (via drill 0.35 pad 1.27)
  other vias: 41.02,23.37
N$376  (via drill 0.35 pad 1.27)
  other vias: 35.94,23.37
N$377  (via drill 0.35 pad 1.27)
  other vias: 33.4,23.37
N$378  (via drill 0.35 pad 1.27)
  other vias: 30.86,25.91
N$379  (via drill 0.35 pad 1.27)
  other vias: 28.32,25.91
N$380  (via drill 0.35 pad 1.27)
  other vias: 25.78,25.91
N$381  (via drill 0.35 pad 1.27)
  other vias: 20.7,25.91
N$382  (via drill 0.35 pad 1.27)
  other vias: 23.24,25.91
N$383  (via drill 0.35 pad 1.27)
  other vias: 18.16,25.91
N$384  (via drill 0.35 pad 1.27)
  other vias: 15.62,25.91
N$385  (via drill 0.35 pad 1.27)
  other vias: 30.86,23.37
N$386  (via drill 0.35 pad 1.27)
  other vias: 28.32,23.37
N$387  (via drill 0.35 pad 1.27)
  other vias: 25.78,23.37
N$388  (via drill 0.35 pad 1.27)
  other vias: 20.7,23.37
N$389  (via drill 0.35 pad 1.27)
  other vias: 23.24,23.37
N$390  (via drill 0.35 pad 1.27)
  other vias: 18.16,23.37
N$391  (via drill 0.35 pad 1.27)
  other vias: 15.62,23.37
N$392  (via drill 0.35 pad 1.27)
  other vias: 10.54,25.91
N$393  (via drill 0.35 pad 1.27)
  other vias: 13.08,25.91
N$396  (via drill 0.35 pad 1.27)
  other vias: 10.54,23.37
N$397  (via drill 0.35 pad 1.27)
  other vias: 13.08,23.37
N$400  (via drill 0.35 pad 1.27)
  other vias: 48.64,81.79
N$401  (via drill 0.35 pad 1.27)
  other vias: 46.1,81.79
N$402  (via drill 0.35 pad 1.27)
  other vias: 43.56,81.79
N$403  (via drill 0.35 pad 1.27)
  other vias: 38.48,81.79
N$404  (via drill 0.35 pad 1.27)
  other vias: 41.02,81.79
N$405  (via drill 0.35 pad 1.27)
  other vias: 35.94,81.79
N$406  (via drill 0.35 pad 1.27)
  other vias: 33.4,81.79
N$407  (via drill 0.35 pad 1.27)
  Top 0.813: SV1.33 v48.64,36.07
  Bottom 0.813: v48.64,36.07 35.94,36.07 R2.1
N$408  (via drill 0.35 pad 1.27)
  other vias: 46.1,79.25
N$409  (via drill 0.35 pad 1.27)
  other vias: 43.56,79.25
N$410  (via drill 0.35 pad 1.27)
  other vias: 38.48,79.25
N$411  (via drill 0.35 pad 1.27)
  other vias: 41.02,79.25
N$412  (via drill 0.35 pad 1.27)
  other vias: 35.94,79.25
N$413  (via drill 0.35 pad 1.27)
  other vias: 33.4,79.25
N$414  (via drill 0.35 pad 1.27)
  other vias: 30.86,81.79
N$415  (via drill 0.35 pad 1.27)
  other vias: 28.32,81.79
N$416  (via drill 0.35 pad 1.27)
  other vias: 25.78,81.79
N$417  (via drill 0.35 pad 1.27)
  other vias: 20.7,81.79
N$418  (via drill 0.35 pad 1.27)
  other vias: 23.24,81.79
N$419  (via drill 0.35 pad 1.27)
  other vias: 18.16,81.79
N$420  (via drill 0.35 pad 1.27)
  other vias: 15.62,81.79
N$421  (via drill 0.35 pad 1.27)
  other vias: 30.86,79.25
N$422  (via drill 0.35 pad 1.27)
  other vias: 28.32,79.25
N$423  (via drill 0.35 pad 1.27)
  other vias: 25.78,79.25
N$424  (via drill 0.35 pad 1.27)
  other vias: 20.7,79.25
N$425  (via drill 0.35 pad 1.27)
  other vias: 23.24,79.25
N$426  (via drill 0.35 pad 1.27)
  other vias: 18.16,79.25
N$427  (via drill 0.35 pad 1.27)
  other vias: 15.62,79.25
N$428  (via drill 0.35 pad 1.27)
  other vias: 10.54,81.79
N$429  (via drill 0.35 pad 1.27)
  other vias: 13.08,81.79
N$432  (via drill 0.35 pad 1.27)
  other vias: 10.54,79.25
N$433  (via drill 0.35 pad 1.27)
  other vias: 13.08,79.25
N$436
  Bottom 0.813: SV3.5 U1.3
N$437  (via drill 0.35 pad 1.27)
  Top 0.813: SV1.10 52.45,65.28 49.91,65.28 v48.64,66.55
  Bottom 0.813: v48.64,66.55 SV4.5
N$438
  Bottom 0.813: R2.2 C1.1 SV4.6
N$439  (via drill 0.35 pad 1.27)
  other vias: 38.48,56.39
N$458  (via drill 0.35 pad 1.27)
  other vias: 30.86,71.63